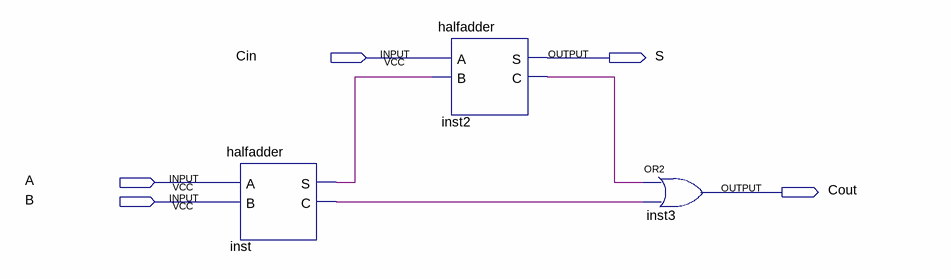
[diagram p0: schematic sheet]
// Quartus schematic adder.bdf as structural Verilog: 3 symbols, 5 pins
module adder (
  input  Cin,
  input  A,
  input  B,
  output S,
  output Cout
);

  wire inst2_c, inst_c, inst_s;

  halfadder inst (.A(A), .B(B), .S(inst_s), .C(inst_c));
  halfadder inst2 (.A(Cin), .B(inst_s), .S(S), .C(inst2_c));
  or inst3 (Cout, inst2_c, inst_c);
endmodule
